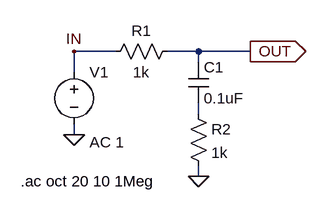
[diagram p0: schematic zero2.asc]
zero2.asc, the LTspice schematic file:
Version 4
SHEET 1 880 680
WIRE 256 80 192 80
WIRE 384 80 336 80
WIRE 464 80 384 80
WIRE 384 96 384 80
WIRE 192 112 192 80
WIRE 384 176 384 160
WIRE 192 208 192 192
WIRE 384 272 384 256
FLAG 192 208 0
FLAG 464 80 OUT
IOPIN 464 80 Out
FLAG 192 80 IN
FLAG 384 272 0
SYMBOL res 352 64 R90
WINDOW 0 0 56 VBottom 2
WINDOW 3 32 56 VTop 2
SYMATTR InstName R1
SYMATTR Value 1k
SYMBOL cap 368 96 R0
SYMATTR InstName C1
SYMATTR Value 0.1uF
SYMBOL voltage 192 96 R0
WINDOW 123 24 124 Left 2
WINDOW 39 0 0 Left 2
SYMATTR InstName V1
SYMATTR Value ""
SYMATTR Value2 AC 1
SYMBOL res 368 160 R0
SYMATTR InstName R2
SYMATTR Value 1k
TEXT 110 280 Left 2 !.ac oct 20 10 1Meg

The netlist it stands for:
* zero2.asc
R1 OUT IN 1k
C1 OUT N001 0.1uF
V1 IN 0 AC 1
R2 N001 0 1k
.ac oct 20 10 1Meg
.backanno
.end